# Altium schematic sheet MCU_STM32F103RCT6.SchDoc: MCU_STM32F103RC
size A; Revision: 1.3; SheetNumber: 1; SheetTotal: 6; ProjectName: BeeWatch
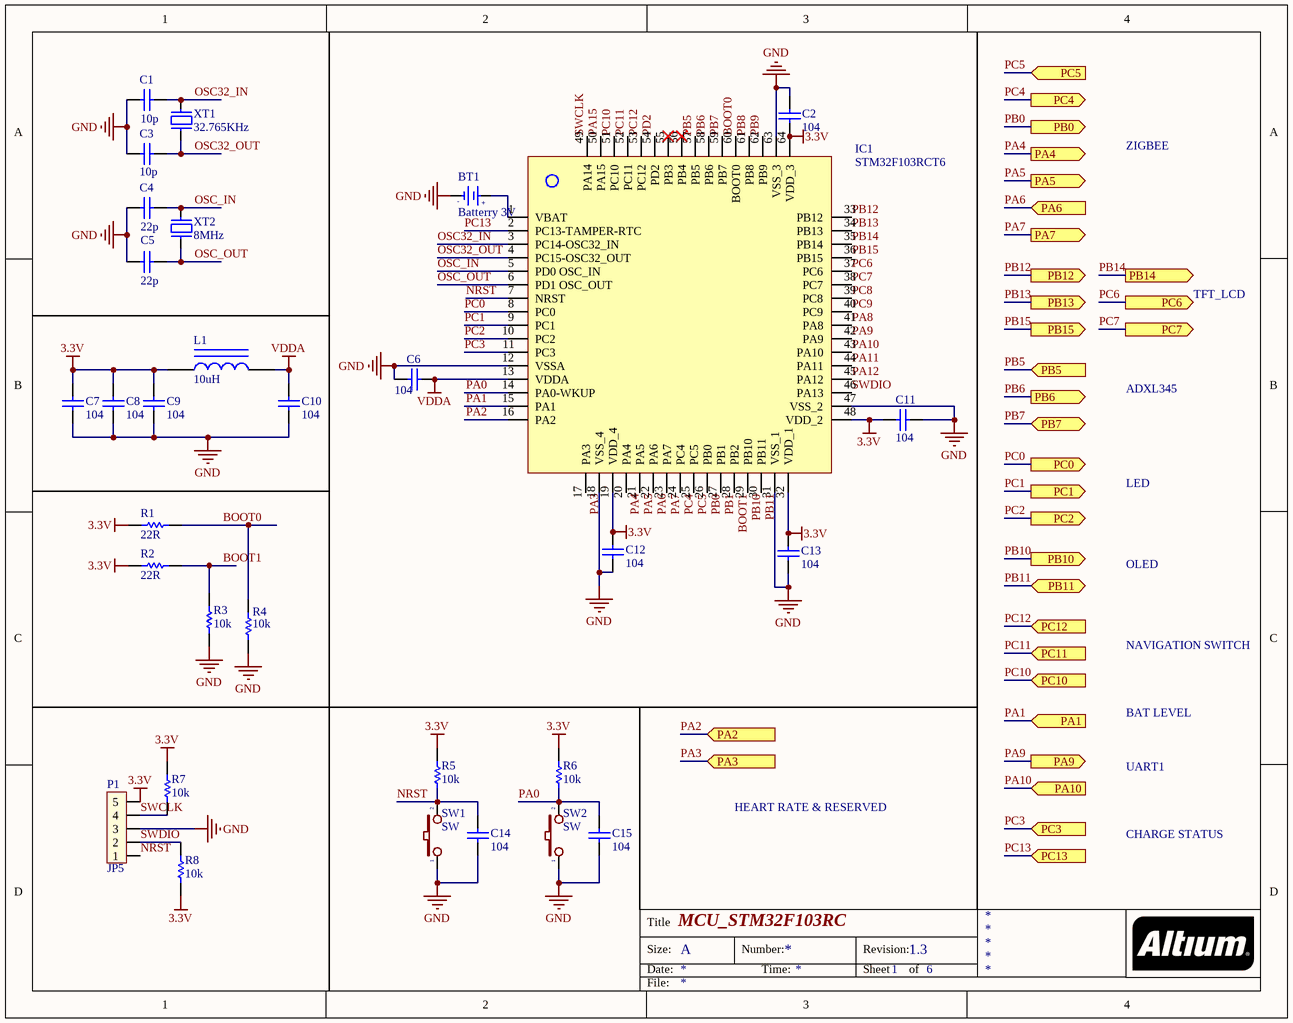
[diagram p0: MCU_STM32F103RCT6.SchDoc]

## Parts
BT1  Batterry 3V  [Battery3V_SMD]
C1  10p  [Cap 0805]
C2  104  [Cap 0805]
C3  10p  [Cap 0805]
C4  22p  [Cap 0805]
C5  22p  [Cap 0805]
C6  104  [Cap 0805]
C7  104  [Cap 0805]
C8  104  [Cap 0805]
C9  104  [Cap 0805]
C10  104  [Cap 0805]
C11  104  [Cap 0805]
C12  104  [Cap 0805]
C13  104  [Cap 0805]
C14  104  [Cap 0805]
C15  104  [Cap 0805]
IC1  STM32F103RCT6  [stm32f103rct6]
L1  10uH  [Inductor 0805]
P1  JP5  [JP5]
R1  22R  [RES 0805]
R2  22R  [RES 0805]
R3  10k  [RES 0805]
R4  10k  [RES 0805]
R5  10k  [RES 0805]
R6  10k  [RES 0805]
R7  10k  [RES 0805]
R8  10k  [RES 0805]
SW1  SW  [sw_ran_2pin]
SW2  SW  [sw_ran_2pin]
XT1  32.765KHz  [XTAL_32K]
XT2  8MHz  [XTAL_6035]

## Ports
PA1 (in), PA2 (in), PA3 (in), PA4 (out), PA5 (out), PA6 (in), PA7 (out), PA9 (out), PA10 (in), PB0 (out), PB5 (in), PB6 (out), PB7, PB10 (out), PB11 (bidir), PB12 (out), PB13 (out), PB14 (out), PB15 (out), PC0 (out), PC1 (out), PC2 (out), PC3 (in), PC4 (out), PC5 (in), PC6 (out), PC7 (out), PC10 (in), PC11 (in), PC12 (in), PC13 (in)

## Nets
3.3V: C2.2 C7.2 C8.2 C9.2 C11.2 C12.2 C13.2 IC1.19(VDD_4) IC1.32(VDD_1) IC1.48(VDD_2) IC1.64(VDD_3) L1.1 P1.5 R1.2 R2.2 R5.2 R6.2 R7.2 R8.1
GND: BT1.2(GND) C1.2 C2.1 C3.2 C4.2 C5.2 C6.2 C7.1 C8.1 C9.1 C10.1 C11.1 C12.1 C13.1 C14.1 C15.1 IC1.12(VSSA) IC1.18(VSS_4) IC1.31(VSS_1) IC1.47(VSS_2) IC1.63(VSS_3) P1.3 R3.1 R4.1 SW1.1 SW2.1
VDDA: C6.1 C10.2 IC1.13(VDDA) L1.2
BOOT0: IC1.60(BOOT0) R1.1 R4.2
BOOT1: IC1.28(PB2) R2.1 R3.2
NRST: C14.2 IC1.7(NRST) P1.1 R5.1 SW1.2
OSC32_IN: C1.1 IC1.3(PC14-OSC32_IN) XT1.2
OSC32_OUT: C3.1 IC1.4(PC15-OSC32_OUT) XT1.1
OSC_IN: C4.1 IC1.5(PD0_OSC_IN) XT2.2
OSC_OUT: C5.1 IC1.6(PD1_OSC_OUT) XT2.1
PA0: C15.2 IC1.14(PA0-WKUP) R6.1 SW2.2
PA1: IC1.15(PA1) ; port PA1
PA2: IC1.16(PA2) ; port PA2
PA3: IC1.17(PA3) ; port PA3
PA4: IC1.20(PA4) ; port PA4
PA5: IC1.21(PA5) ; port PA5
PA6: IC1.22(PA6) ; port PA6
PA7: IC1.23(PA7) ; port PA7
PA8: IC1.41(PA8)
PA9: IC1.42(PA9) ; port PA9
PA10: IC1.43(PA10) ; port PA10
PA11: IC1.44(PA11)
PA12: IC1.45(PA12)
PA15: IC1.50(PA15)
PB0: IC1.26(PB0) ; port PB0
PB1: IC1.27(PB1)
PB5: IC1.57(PB5) ; port PB5
PB6: IC1.58(PB6) ; port PB6
PB7: IC1.59(PB7) ; port PB7
PB8: IC1.61(PB8)
PB9: IC1.62(PB9)
PB10: IC1.29(PB10) ; port PB10
PB11: IC1.30(PB11) ; port PB11
PB12: IC1.33(PB12) ; port PB12
PB13: IC1.34(PB13) ; port PB13
PB14: IC1.35(PB14) ; port PB14
PB15: IC1.36(PB15) ; port PB15
PC0: IC1.8(PC0) ; port PC0
PC1: IC1.9(PC1) ; port PC1
PC2: IC1.10(PC2) ; port PC2
PC3: IC1.11(PC3) ; port PC3
PC4: IC1.24(PC4) ; port PC4
PC5: IC1.25(PC5) ; port PC5
PC6: IC1.37(PC6) ; port PC6
PC7: IC1.38(PC7) ; port PC7
PC8: IC1.39(PC8)
PC9: IC1.40(PC9)
PC10: IC1.51(PC10) ; port PC10
PC11: IC1.52(PC11) ; port PC11
PC12: IC1.53(PC12) ; port PC12
PC13: IC1.2(PC13-TAMPER-RTC) ; port PC13
PD2: IC1.54(PD2)
SWCLK: IC1.49(PA14) P1.4 R7.1
SWDIO: IC1.46(PA13) P1.2 R8.2
NetBT1_1: BT1.1(+3V) IC1.1(VBAT)

Not connected (* = marked no-connect by the designer): IC1 55(PB3)* 56(PB4)*

## Notes on the sheet
- ZIGBEE
- TFT_LCD
- ADXL345
- LED
- OLED
- NAVIGATION SWITCH
- BAT LEVEL
- UART1
- HEART RATE & RESERVED
- CHARGE STATUS
- Title
- Size:
- Date:
- A
- Number:
- Time:
- Revision:
- Sheet
- of
- File:
- (in symbol Battery3V) -; +

## Library data of the parts
BT1 = Battery3V
C1-C15 = Cap_0805
L1 = inductor_0805: inductor 0805
R1-R8 = Res_0805: resistor smd0805
SW1 SW2 = SW2: Switch button 2 pin; Value: SW chip 2 pin
XT1 XT2 = Xtal